# EasyEDA schematic SCH_VFD_Driver_PT6315_2025-07-27.json
TITLE: Sheet_1; REV: 1.0; Date: 2025-03-04; Sheet: 1/1; Drawn By: pashiran; Company: Your Company
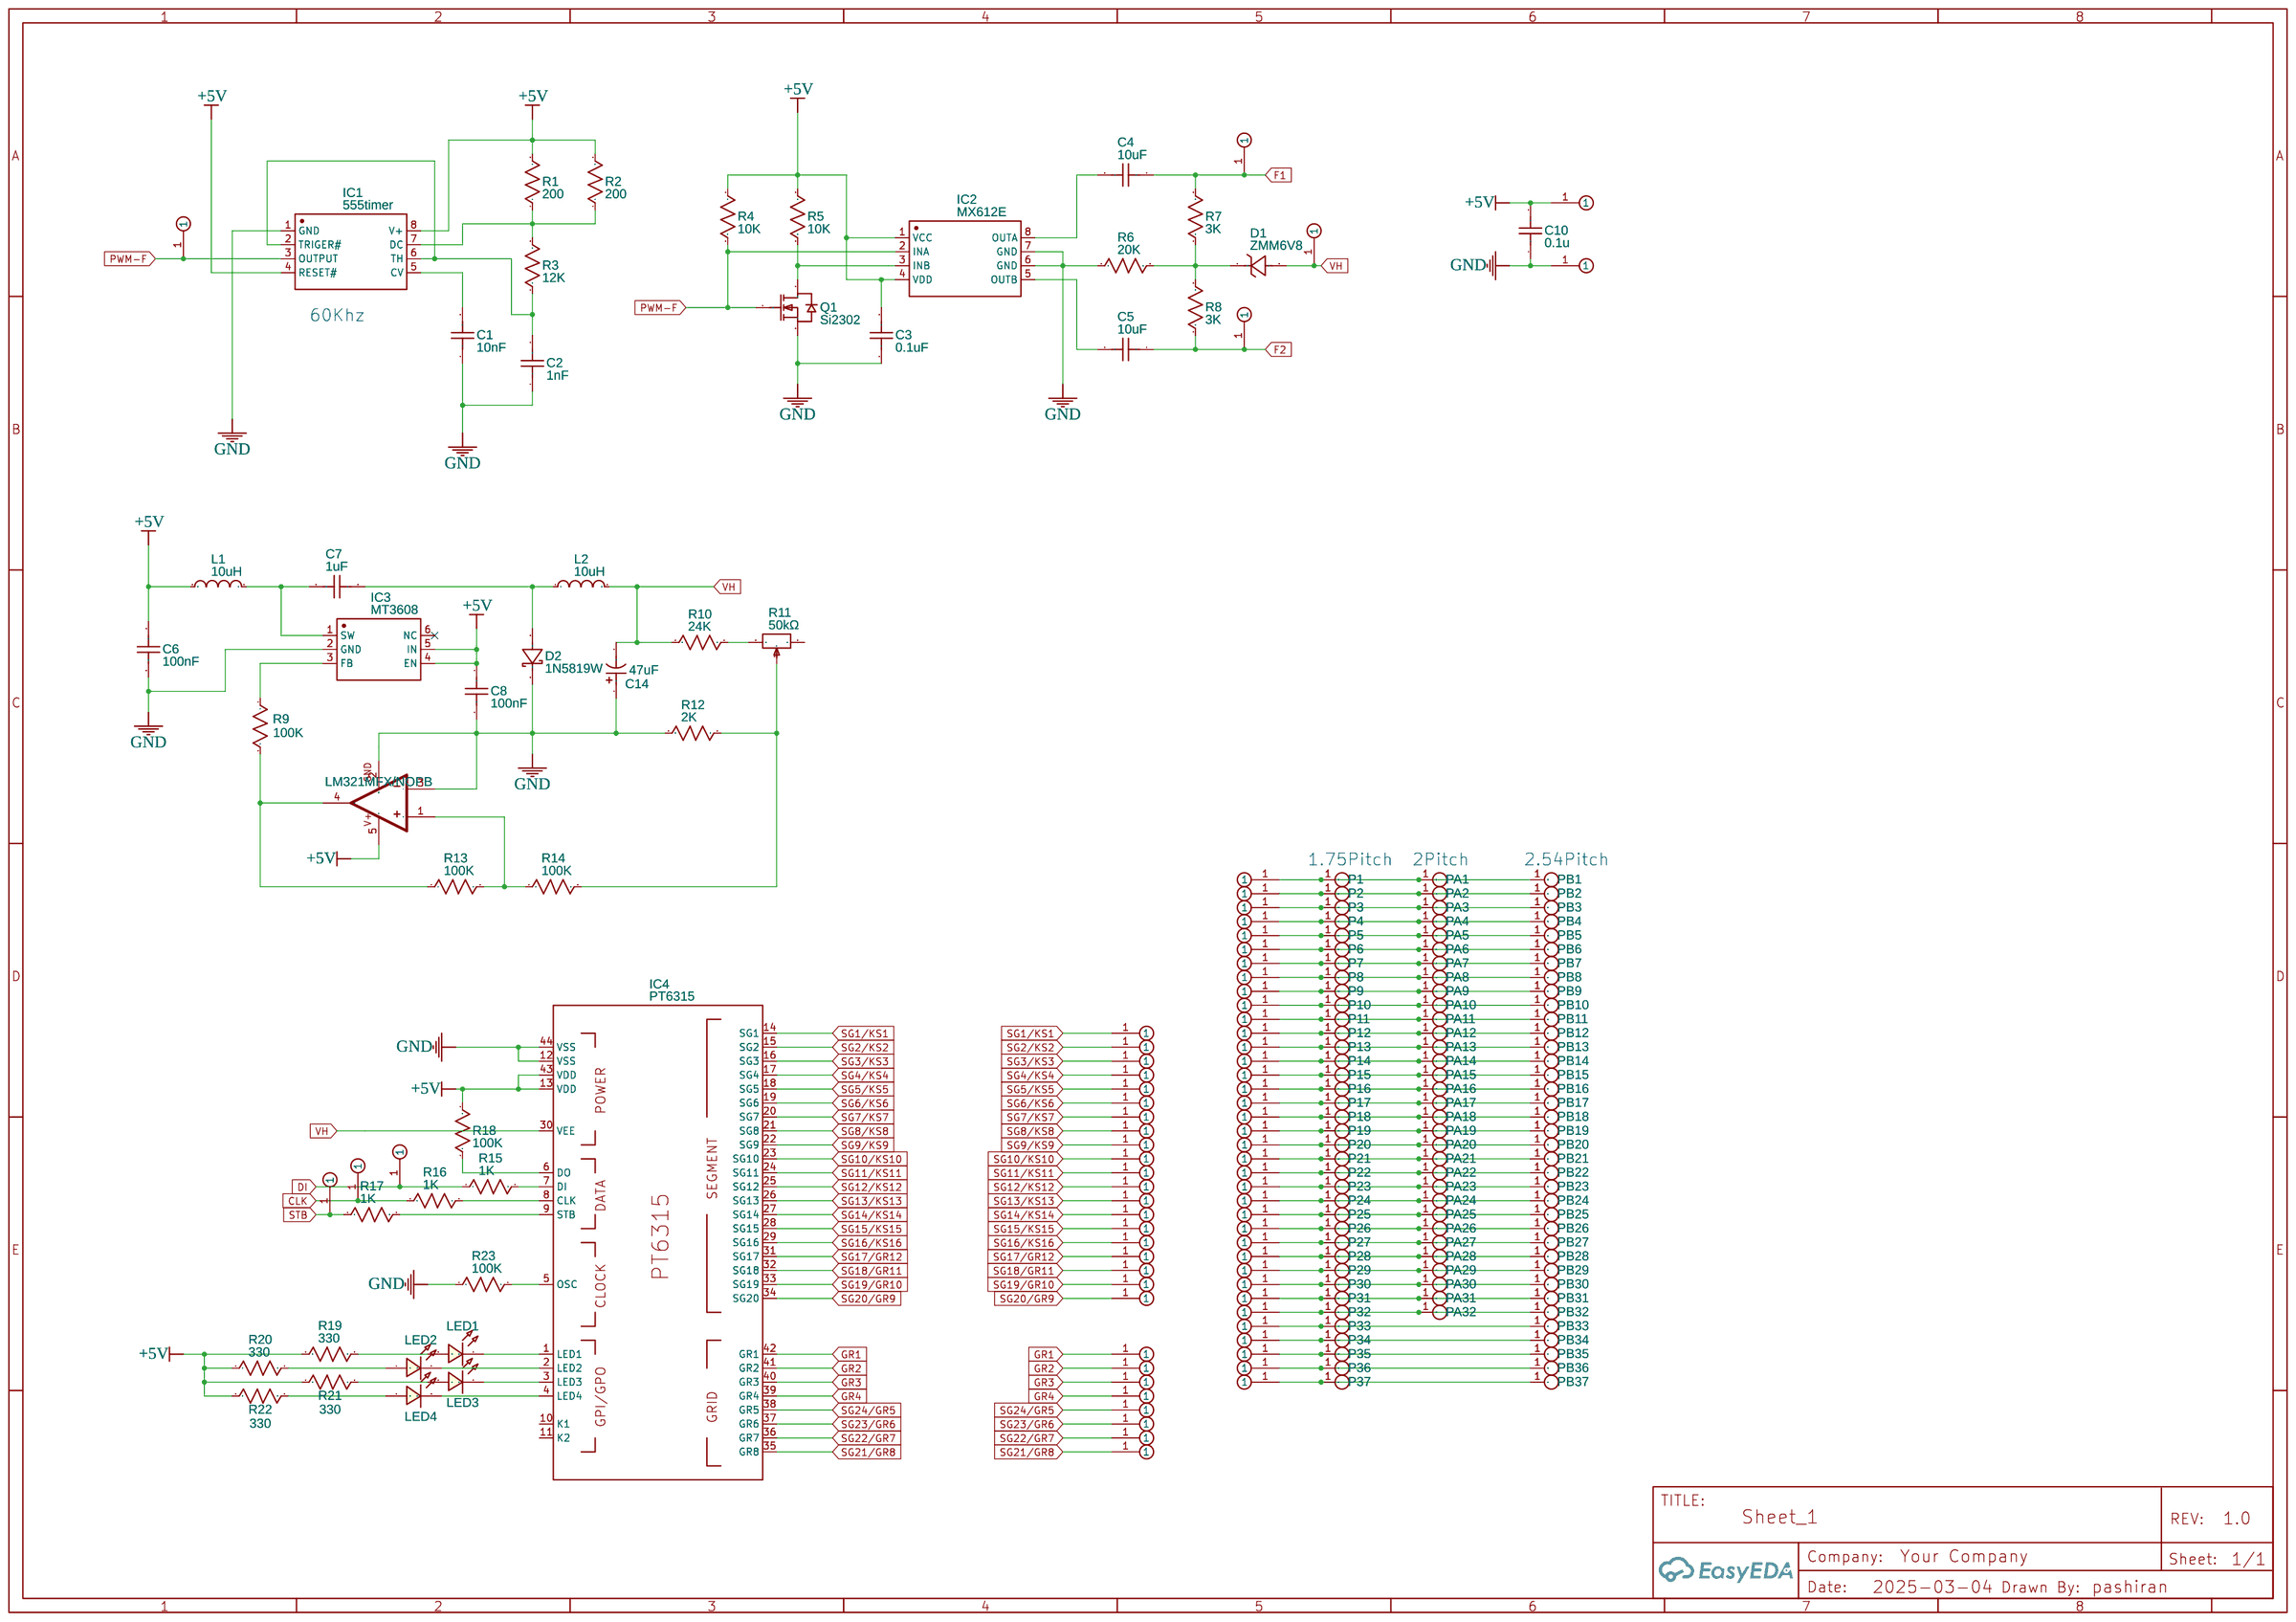
[diagram p0: schematic sheet]

## Parts
C1  10nF  [C0805]
C2  1nF  [C0805]
C3  0.1uF  [C0805]
C4  10uF  [C0805]
C5  10uF  [C0805]
C6  100nF  [C0805]
C7  1uF  [C0805]
C8  100nF  [C0805]
C10  0.1u  [C0805]
C14  47uF  [CAP-SMD_BD6.3-L6.5-W6.5-LS7.0-FD]
CLK  SMD-PAD-Mini  [SMD-PAD]
D1  ZMM6V8  [LL-34_L3.5-W1.5-RD]
D2  1N5819W  [SOD-123_L2.7-W1.6-LS3.7-R-RD]
DI  SMD-PAD-Mini  [SMD-PAD]
F1  SMD-PAD-Mini  [SMD-PAD]
F2  SMD-PAD-Mini  [SMD-PAD]
GND  SMD-PAD-Mini  [SMD-PAD]
IC1  555timer  [SOIC-8_L4.9-W3.9-P1.27-LS6.0-BL]
IC2  MX612E  [SOP-8_L4.9-W3.9-P1.27-LS6.0-BL]
IC3  MT3608  [SOT-23-6_L2.9-W1.6-P0.95-LS2.8-BL]
IC4  PT6315  [TQFP44-0.8-9.6X9.6MM]
L1  10uH  [IND-SMD_L4.5-W4.5_SMMS0420]
L2  10uH  [IND-SMD_L4.5-W4.5_SMMS0420]
LED1  LED-0805_R  [LED0805_RED]
LED2  LED-0805_R  [LED0805_RED]
LED3  LED-0805_R  [LED0805_RED]
LED4  LED-0805_R  [LED0805_RED]
P1  CON PAD  [PADPAD]
P2  CON PAD  [PADPAD]
P3  CON PAD  [PADPAD]
P4  CON PAD  [PADPAD]
P5  CON PAD  [PADPAD]
P6  CON PAD  [PADPAD]
P7  CON PAD  [PADPAD]
P8  CON PAD  [PADPAD]
P9  CON PAD  [PADPAD]
P10  CON PAD  [PADPAD]
P11  CON PAD  [PADPAD]
P12  CON PAD  [PADPAD]
P13  CON PAD  [PADPAD]
P14  CON PAD  [PADPAD]
P15  CON PAD  [PADPAD]
P16  CON PAD  [PADPAD]
P17  CON PAD  [PADPAD]
P18  CON PAD  [PADPAD]
P19  CON PAD  [PADPAD]
P20  CON PAD  [PADPAD]
P21  CON PAD  [PADPAD]
P22  CON PAD  [PADPAD]
P23  CON PAD  [PADPAD]
P24  CON PAD  [PADPAD]
P25  CON PAD  [PADPAD]
P26  CON PAD  [PADPAD]
P27  CON PAD  [PADPAD]
P28  CON PAD  [PADPAD]
P29  CON PAD  [PADPAD]
P30  CON PAD  [PADPAD]
P31  CON PAD  [PADPAD]
P32  CON PAD  [PADPAD]
P33  CON PAD  [PADPAD]
P34  CON PAD  [PADPAD]
P35  CON PAD  [PADPAD]
P36  CON PAD  [PADPAD]
P37  CON PAD  [PADPAD]
PA1  CON PAD  [PADPAD]
PA2  CON PAD  [PADPAD]
PA3  CON PAD  [PADPAD]
PA4  CON PAD  [PADPAD]
PA5  CON PAD  [PADPAD]
PA6  CON PAD  [PADPAD]
PA7  CON PAD  [PADPAD]
PA8  CON PAD  [PADPAD]
PA9  CON PAD  [PADPAD]
PA10  CON PAD  [PADPAD]
PA11  CON PAD  [PADPAD]
PA12  CON PAD  [PADPAD]
PA13  CON PAD  [PADPAD]
PA14  CON PAD  [PADPAD]
PA15  CON PAD  [PADPAD]
PA16  CON PAD  [PADPAD]
PA17  CON PAD  [PADPAD]
PA18  CON PAD  [PADPAD]
PA19  CON PAD  [PADPAD]
PA20  CON PAD  [PADPAD]
PA21  CON PAD  [PADPAD]
PA22  CON PAD  [PADPAD]
PA23  CON PAD  [PADPAD]
PA24  CON PAD  [PADPAD]
PA25  CON PAD  [PADPAD]
PA26  CON PAD  [PADPAD]
PA27  CON PAD  [PADPAD]
PA28  CON PAD  [PADPAD]
PA29  CON PAD  [PADPAD]
PA30  CON PAD  [PADPAD]
PA31  CON PAD  [PADPAD]
PA32  CON PAD  [PADPAD]
PB1  CON PAD  [PADPAD]
PB2  CON PAD  [PADPAD]
PB3  CON PAD  [PADPAD]
PB4  CON PAD  [PADPAD]
PB5  CON PAD  [PADPAD]
PB6  CON PAD  [PADPAD]
PB7  CON PAD  [PADPAD]
PB8  CON PAD  [PADPAD]
PB9  CON PAD  [PADPAD]
PB10  CON PAD  [PADPAD]
PB11  CON PAD  [PADPAD]
PB12  CON PAD  [PADPAD]
PB13  CON PAD  [PADPAD]
PB14  CON PAD  [PADPAD]
PB15  CON PAD  [PADPAD]
PB16  CON PAD  [PADPAD]
PB17  CON PAD  [PADPAD]
PB18  CON PAD  [PADPAD]
PB19  CON PAD  [PADPAD]
PB20  CON PAD  [PADPAD]
PB21  CON PAD  [PADPAD]
PB22  CON PAD  [PADPAD]
PB23  CON PAD  [PADPAD]
PB24  CON PAD  [PADPAD]
PB25  CON PAD  [PADPAD]
PB26  CON PAD  [PADPAD]
PB27  CON PAD  [PADPAD]
PB28  CON PAD  [PADPAD]
PB29  CON PAD  [PADPAD]
PB30  CON PAD  [PADPAD]
PB31  CON PAD  [PADPAD]
PB32  CON PAD  [PADPAD]
PB33  CON PAD  [PADPAD]
PB34  CON PAD  [PADPAD]
PB35  CON PAD  [PADPAD]
PB36  CON PAD  [PADPAD]
PB37  CON PAD  [PADPAD]
PWM  SMD-PAD-Mini  [SMD-PAD]
Q1  Si2302  [SOT-23_L2.9-W1.3-P1.90-LS2.4-BR]
R1  200  [R0805]
R2  200  [R0805]
R3  12K  [R0805]
R4  10K  [R0805]
R5  10K  [R0805]
R6  20K  [R0805]
R7  3K  [R0805]
R8  3K  [R0805]
R9  100K  [R0805]
R10  24K  [R0805]
R11  50kΩ  [RES-ADJ-SMD_VG039NCH]
R12  2K  [R0805]
R13  100K  [R0805]
R14  100K  [R0805]
R15  1K  [R0805]
R16  1K  [R0805]
R17  1K  [R0805]
R18  100K  [R0805]
R19  330  [R0805]
R20  330  [R0805]
R21  330  [R0805]
R22  330  [R0805]
R23  100K  [R0805]
STB  SMD-PAD-Mini  [SMD-PAD]
U1  SMD-PAD-Mini  [SMD-PAD]
U2  SMD-PAD-Mini  [SMD-PAD]
U3  SMD-PAD-Mini  [SMD-PAD]
U4  SMD-PAD-Mini  [SMD-PAD]
U5  SMD-PAD-Mini  [SMD-PAD]
U6  SMD-PAD-Mini  [SMD-PAD]
U7  SMD-PAD-Mini  [SMD-PAD]
U8  SMD-PAD-Mini  [SMD-PAD]
U9  SMD-PAD-Mini  [SMD-PAD]
U10  SMD-PAD-Mini  [SMD-PAD]
U11  SMD-PAD-Mini  [SMD-PAD]
U12  SMD-PAD-Mini  [SMD-PAD]
U13  SMD-PAD-Mini  [SMD-PAD]
U14  SMD-PAD-Mini  [SMD-PAD]
U15  SMD-PAD-Mini  [SMD-PAD]
U16  SMD-PAD-Mini  [SMD-PAD]
U17  SMD-PAD-Mini  [SMD-PAD]
U18  SMD-PAD-Mini  [SMD-PAD]
U19  SMD-PAD-Mini  [SMD-PAD]
U20  SMD-PAD-Mini  [SMD-PAD]
U21  SMD-PAD-Mini  [SMD-PAD]
U22  SMD-PAD-Mini  [SMD-PAD]
U23  SMD-PAD-Mini  [SMD-PAD]
U24  SMD-PAD-Mini  [SMD-PAD]
U25  SMD-PAD-Mini  [SMD-PAD]
U26  SMD-PAD-Mini  [SMD-PAD]
U27  SMD-PAD-Mini  [SMD-PAD]
U28  SMD-PAD-Mini  [SMD-PAD]
U29  SMD-PAD-Mini  [SMD-PAD]
U30  SMD-PAD-Mini  [SMD-PAD]
U31  SMD-PAD-Mini  [SMD-PAD]
U32  SMD-PAD-Mini  [SMD-PAD]
U33  SMD-PAD-Mini  [SMD-PAD]
U34  SMD-PAD-Mini  [SMD-PAD]
U35  SMD-PAD-Mini  [SMD-PAD]
U36  SMD-PAD-Mini  [SMD-PAD]
U37  SMD-PAD-Mini  [SMD-PAD]
U38  SMD-PAD-Mini  [SMD-PAD]
U39  SMD-PAD-Mini  [SMD-PAD]
U40  SMD-PAD-Mini  [SMD-PAD]
U41  SMD-PAD-Mini  [SMD-PAD]
U42  SMD-PAD-Mini  [SMD-PAD]
U43  SMD-PAD-Mini  [SMD-PAD]
U44  SMD-PAD-Mini  [SMD-PAD]
U45  SMD-PAD-Mini  [SMD-PAD]
U46  SMD-PAD-Mini  [SMD-PAD]
U47  SMD-PAD-Mini  [SMD-PAD]
U48  SMD-PAD-Mini  [SMD-PAD]
U49  SMD-PAD-Mini  [SMD-PAD]
U50  SMD-PAD-Mini  [SMD-PAD]
U51  SMD-PAD-Mini  [SMD-PAD]
U52  SMD-PAD-Mini  [SMD-PAD]
U53  SMD-PAD-Mini  [SMD-PAD]
U54  SMD-PAD-Mini  [SMD-PAD]
U55  SMD-PAD-Mini  [SMD-PAD]
U56  SMD-PAD-Mini  [SMD-PAD]
U57  SMD-PAD-Mini  [SMD-PAD]
U58  SMD-PAD-Mini  [SMD-PAD]
U59  SMD-PAD-Mini  [SMD-PAD]
U60  SMD-PAD-Mini  [SMD-PAD]
U61  SMD-PAD-Mini  [SMD-PAD]
U62  SMD-PAD-Mini  [SMD-PAD]
U63  SMD-PAD-Mini  [SMD-PAD]
U64  SMD-PAD-Mini  [SMD-PAD]
U65  SMD-PAD-Mini  [SMD-PAD]
U67  LM321MFX/NOPB  [SOT-23-5_L3.0-W1.7-P0.95-LS2.8-BR]
VCC  SMD-PAD-Mini  [SMD-PAD]
VH  SMD-PAD-Mini  [SMD-PAD]

## Library data of the parts
C1-C8 C10 = C_0805_US: Contributor: LCEDA_Lib
C14 = FVH025ADA470M0654: Supplier: LCSC; Supplier Part: C7469965; Manufacturer: FOSAN(富捷/富信); JLCPCB Part Class: Extended Part; Contributor: lcsc
CLK DI F1 F2 GND PWM STB U1-U65 VCC VH = SMD-PAD-Mini: Contributor: Sreejith Sreedharan
D1 = ZMM6V8_C5345995: Supplier: LCSC; Supplier Part: C5345995; Manufacturer: HXY MOSFET(华轩阳电子); JLCPCB Part Class: Extended Part; Contributor: lcsc
D2 = 1N5819W_C2683619: Contributor: LCSC; Supplier: LCSC; Supplier Part: C2683619; Manufacturer: ZHIDE(志得); JLCPCB Part Class: Extended Part
IC1 = LMC555CMX/NOPB: Supplier: LCSC; Manufacturer: TI(德州仪器); Supplier Part: C90760; JLCPCB Part Class: Extended Part
IC2 = MX612E: Supplier: LCSC; Manufacturer: Mixic(中科芯亿达); Supplier Part: C110207; JLCPCB Part Class: Extended Part
IC3 = MT3608: Supplier: LCSC; Manufacturer: 西安航天民芯; Supplier Part: C84817; JLCPCB Part Class: Extended Part
IC4 = PT6315: Contributor: pashiran
L1 L2 = SMMS0420-100M: Supplier: LCSC; Manufacturer: SXN(顺翔诺); Supplier Part: C133195; JLCPCB Part Class: Extended Part
LED1-LED4 = LED-0805_R: Manufacturer: EVERLIGHT(台湾亿光); Manufacturer Part: 17-21SURC/S530-A3/TR8; Supplier Part: C72037; Contributor: LCEDA_Lib
P1-P37 PA1-PA32 PB1-PB37 = CON PAD: Contributor: crzdizzy
Q1 = Si2302CDS-T1-GE3: Supplier: LCSC; Manufacturer: VISHAY(威世); Supplier Part: C10488; JLCPCB Part Class: Extended Part
R1-R10 R12-R23 = R_0805_US: Contributor: LCEDA_Lib
R11 = VG039NCHXTB503: Resistance(Ohms): 50K; Supplier: LCSC; Manufacturer: HDK(北陆电气); Supplier Part: C145161; JLCPCB Part Class: Extended Part
U67 = LM321MFX/NOPB: Supplier: LCSC; Manufacturer: TI(德州仪器); Supplier Part: C9405; JLCPCB Part Class: Extended Part

## Nets
+5V: C3.2 C6.1 C8.1 C10.2 IC1.4(RESET#) IC1.8(V+) IC2.1(VCC) IC2.4(VDD) IC3.4(EN) IC3.5(IN) IC4.13(VDD) IC4.43(VDD) L1.1 R1.2 R2.2 R4.1 R5.1 R18.2 R19.1 R20.1 R21.1 R22.1 U67.5(V+) VCC.1
GND: C1.1 C2.1 C3.1 C6.2 C8.2 C10.1 C14.1 D2.2(K) GND.1 IC1.1(GND) IC2.6(GND) IC2.7(GND) IC3.2(GND) IC4.12(VSS) IC4.44(VSS) Q1.2(S) R6.1 R12.2 R23.1 U67.2(GND) U67.3(-)
CLK: CLK.1 R16.1
DI: DI.1 R15.1
F1: C4.1 F1.1 R7.2
F2: C5.1 F2.1 R8.1
GR1: IC4.42(GR1) U21.1
GR2: IC4.41(GR2) U22.1
GR3: IC4.40(GR3) U23.1
GR4: IC4.39(GR4) U24.1
PWM-F: IC1.3(OUTPUT) IC2.2(INA) PWM.1 Q1.1(G) R4.2
SG1/KS1: IC4.14(SG1) U1.1
SG2/KS2: IC4.15(SG2) U2.1
SG3/KS3: IC4.16(SG3) U3.1
SG4/KS4: IC4.17(SG4) U4.1
SG5/KS5: IC4.18(SG5) U5.1
SG6/KS6: IC4.19(SG6) U6.1
SG7/KS7: IC4.20(SG7) U7.1
SG8/KS8: IC4.21(SG8) U8.1
SG9/KS9: IC4.22(SG9) U9.1
SG10/KS10: IC4.23(SG10) U10.1
SG11/KS11: IC4.24(SG11) U11.1
SG12/KS12: IC4.25(SG12) U12.1
SG13/KS13: IC4.26(SG13) U13.1
SG14/KS14: IC4.27(SG14) U14.1
SG15/KS15: IC4.28(SG15) U15.1
SG16/KS16: IC4.29(SG16) U16.1
SG17/GR12: IC4.31(SG17) U17.1
SG18/GR11: IC4.32(SG18) U18.1
SG19/GR10: IC4.33(SG19) U19.1
SG20/GR9: IC4.34(SG20) U20.1
SG21/GR8: IC4.35(GR8) U28.1
SG22/GR7: IC4.36(GR7) U27.1
SG23/GR6: IC4.37(GR6) U26.1
SG24/GR5: IC4.38(GR5) U25.1
STB: R17.1 STB.1
VH: C14.2 D1.2(A) IC4.30(VEE) L2.2 R10.1 VH.1
Net-(C1-2): C1.2 IC1.5(CV)
Net-(C2-2): C2.2 IC1.2(TRIGER#) IC1.6(TH) R3.1
Net-(C4-2): C4.2 IC2.8(OUTA)
Net-(C5-2): C5.2 IC2.5(OUTB)
Net-(C7-1): C7.1 IC3.1(SW) L1.2
Net-(C7-2): C7.2 D2.1(A) L2.1
Net-(D1-1): D1.1(C) R6.2 R7.1 R8.2
Net-(IC1-7): IC1.7(DC) R1.1 R2.1 R3.2
Net-(IC2-3): IC2.3(INB) Q1.3(D) R5.2
Net-(IC3-3): IC3.3(FB) R9.1
Net-(IC4-1): IC4.1(LED1) LED1.2
Net-(IC4-2): IC4.2(LED2) LED2.2
Net-(IC4-3): IC4.3(LED3) LED3.2
Net-(IC4-4): IC4.4(LED4) LED4.2
Net-(IC4-5): IC4.5(OSC) R23.2
Net-(IC4-6): IC4.6(DO) R18.1
Net-(IC4-7): IC4.7(DI) R15.2
Net-(IC4-8): IC4.8(CLK) R16.2
Net-(IC4-9): IC4.9(STB) R17.2
Net-(LED1-1): LED1.1 R19.2
Net-(LED2-1): LED2.1 R20.2
Net-(LED3-1): LED3.1 R21.2
Net-(LED4-1): LED4.1 R22.2
Net-(P1-1): P1.1(Pad) PA1.1(Pad) PB1.1(Pad) U29.1
Net-(P2-1): P2.1(Pad) PA2.1(Pad) PB2.1(Pad) U30.1
Net-(P3-1): P3.1(Pad) PA3.1(Pad) PB3.1(Pad) U31.1
Net-(P4-1): P4.1(Pad) PA4.1(Pad) PB4.1(Pad) U32.1
Net-(P5-1): P5.1(Pad) PA5.1(Pad) PB5.1(Pad) U33.1
Net-(P6-1): P6.1(Pad) PA6.1(Pad) PB6.1(Pad) U34.1
Net-(P7-1): P7.1(Pad) PA7.1(Pad) PB7.1(Pad) U35.1
Net-(P8-1): P8.1(Pad) PA8.1(Pad) PB8.1(Pad) U36.1
Net-(P9-1): P9.1(Pad) PA9.1(Pad) PB9.1(Pad) U37.1
Net-(P10-1): P10.1(Pad) PA10.1(Pad) PB10.1(Pad) U38.1
Net-(P11-1): P11.1(Pad) PA11.1(Pad) PB11.1(Pad) U39.1
Net-(P12-1): P12.1(Pad) PA12.1(Pad) PB12.1(Pad) U40.1
Net-(P13-1): P13.1(Pad) PA13.1(Pad) PB13.1(Pad) U41.1
Net-(P14-1): P14.1(Pad) PA14.1(Pad) PB14.1(Pad) U42.1
Net-(P15-1): P15.1(Pad) PA15.1(Pad) PB15.1(Pad) U43.1
Net-(P16-1): P16.1(Pad) PA16.1(Pad) PB16.1(Pad) U44.1
Net-(P17-1): P17.1(Pad) PA17.1(Pad) PB17.1(Pad) U45.1
Net-(P18-1): P18.1(Pad) PA18.1(Pad) PB18.1(Pad) U46.1
Net-(P19-1): P19.1(Pad) PA19.1(Pad) PB19.1(Pad) U47.1
Net-(P20-1): P20.1(Pad) PA20.1(Pad) PB20.1(Pad) U48.1
Net-(P21-1): P21.1(Pad) PA21.1(Pad) PB21.1(Pad) U49.1
Net-(P22-1): P22.1(Pad) PA22.1(Pad) PB22.1(Pad) U50.1
Net-(P23-1): P23.1(Pad) PA23.1(Pad) PB23.1(Pad) U51.1
Net-(P24-1): P24.1(Pad) PA24.1(Pad) PB24.1(Pad) U52.1
Net-(P25-1): P25.1(Pad) PA25.1(Pad) PB25.1(Pad) U53.1
Net-(P26-1): P26.1(Pad) PA26.1(Pad) PB26.1(Pad) U54.1
Net-(P27-1): P27.1(Pad) PA27.1(Pad) PB27.1(Pad) U55.1
Net-(P28-1): P28.1(Pad) PA28.1(Pad) PB28.1(Pad) U56.1
Net-(P29-1): P29.1(Pad) PA29.1(Pad) PB29.1(Pad) U57.1
Net-(P30-1): P30.1(Pad) PA30.1(Pad) PB30.1(Pad) U58.1
Net-(P31-1): P31.1(Pad) PA31.1(Pad) PB31.1(Pad) U59.1
Net-(P32-1): P32.1(Pad) PA32.1(Pad) PB32.1(Pad) U60.1
Net-(P33-1): P33.1(Pad) PB33.1(Pad) U61.1
Net-(P34-1): P34.1(Pad) PB34.1(Pad) U62.1
Net-(P35-1): P35.1(Pad) PB35.1(Pad) U63.1
Net-(P36-1): P36.1(Pad) PB36.1(Pad) U64.1
Net-(P37-1): P37.1(Pad) PB37.1(Pad) U65.1
Net-(R9-2): R9.2 R13.1 U67.4(OUT)
Net-(R10-2): R10.2 R11.3
Net-(R11-2): R11.2 R12.1 R14.2
Net-(R13-2): R13.2 R14.1 U67.1(+)

Not connected (* = marked no-connect by the designer): IC3 6(NC)*; IC4 10(K1) 11(K2); R11 1

## Notes on the sheet
- 60Khz
- 음전압
- 1.75Pitch
- 2Pitch
- 2.54Pitch
